# Altium schematic sheet AdjRegSection.SchDoc
size A3; SheetNumber: 1; SheetTotal: 3
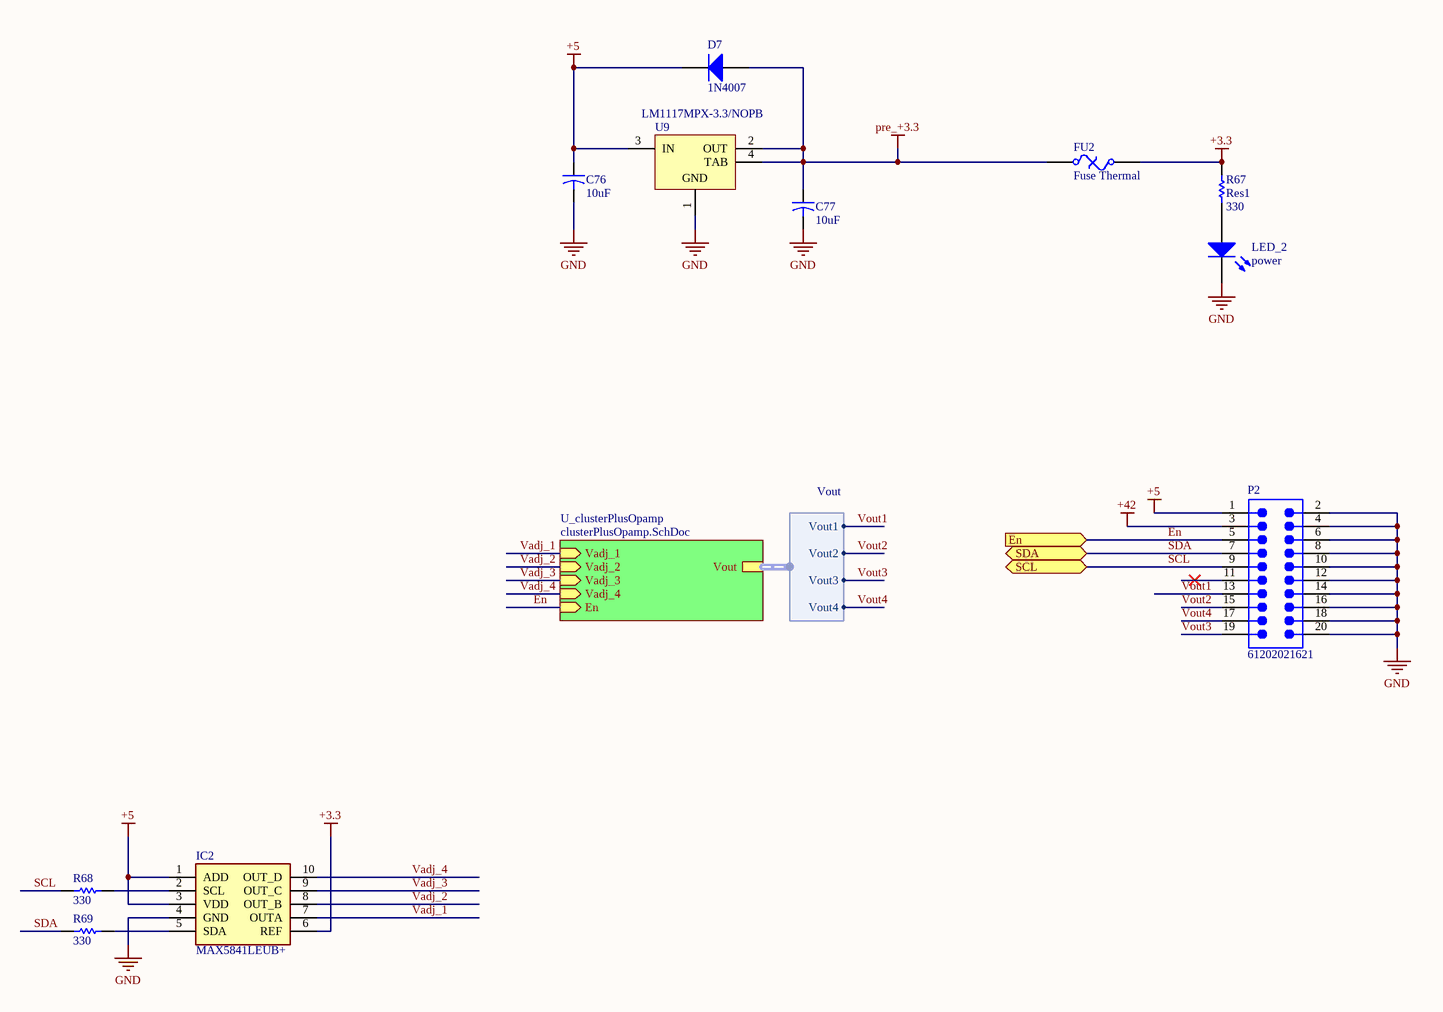
[diagram p0: AdjRegSection.SchDoc]

## Parts
C76  value 10uF  [0805C]  (hidden comment: Cap_El)
C77  value 10uF  [0805C]  (hidden comment: Cap_El)
D7  1N4007  [430X270D]
FU2  Fuse Thermal  [1206]
IC2  MAX5841LEUB+  [SOP50P490X110-10N]
LED_2  power  [0805LED]
P2  61202021621  [61202021621]
R67  Res1  value 330  [0805L]
R68  330  [RESC3216X70X50NL05T20]
R69  330  [RESC3216X70X50NL05T20]
U9  LM1117MPX-3.3/NOPB  [DCY0004A_L]

## Sub-sheets
U_clusterPlusOpamp = clusterPlusOpamp.SchDoc: En (in), Vadj_1 (in), Vadj_2 (in), Vadj_3 (in), Vadj_4 (in), Vout (harness Vout)

## Ports
En (in), SCL (bidir), SDA (bidir)

## Harnesses
Vout: Vout1, Vout2, Vout3, Vout4

## Nets
+3.3: FU2.2 IC2.6(REF) R67.1
+5: C76.1 D7.2(K) IC2.1(ADD) IC2.3(VDD) P2.1 U9.3(IN)
+42: P2.3
GND: C76.2 C77.2 IC2.4(GND) LED_2.2(K) P2.2 P2.4 P2.6 P2.8 P2.10 P2.12 P2.14 P2.16 P2.18 P2.20 U9.1(GND)
pre_+3.3: C77.1 D7.1(A) FU2.1 U9.2(OUT) U9.4(TAB)
En: P2.5 ; port En, sheet U_clusterPlusOpamp/En
SCL: P2.9 R68.2 ; port SCL
SDA: P2.7 R69.2 ; port SDA
Vadj_1: IC2.7(OUTA) ; sheet U_clusterPlusOpamp/Vadj_1
Vadj_2: IC2.8(OUT_B) ; sheet U_clusterPlusOpamp/Vadj_2
Vadj_3: IC2.9(OUT_C) ; sheet U_clusterPlusOpamp/Vadj_3
Vadj_4: IC2.10(OUT_D) ; sheet U_clusterPlusOpamp/Vadj_4
Vout1: P2.13 ; sheet U_clusterPlusOpamp/Vout.Vout1
Vout2: P2.15 ; sheet U_clusterPlusOpamp/Vout.Vout2
Vout3: P2.19 ; sheet U_clusterPlusOpamp/Vout.Vout3
Vout4: P2.17 ; sheet U_clusterPlusOpamp/Vout.Vout4
NetIC2_2: IC2.2(SCL) R68.1
NetIC2_5: IC2.5(SDA) R69.1
NetLED_2_1: LED_2.1(A) R67.2

Not connected (* = marked no-connect by the designer): P2 11*

## Library data of the parts
C76 C77 = Cap_El: Capacitor; Published: 23-Sep-2002; PackageReference: CAPR5-4X5; Publisher: Altium Limited
D7 = Diode: 1 Amp General Purpose Rectifier; Revision 1: 11-Jul-2000: SIM Model Added.; Revision 2: 17-Jul-2002: Re-released for DXP Platform.; Package Information: Latest Revision: Aug-1999; Code - JEDEC: DO-204-AL; Published: 8-Jun-2000; Datasheet: Latest Revision: 1998; Package Reference: DO-41; Publisher: Altium Limited
FU2 = Fuse Thermal: Thermal Fuse; Published: 24-Mar-1999; LatestRevisionDate: 17-Jul-2002; LatestRevisionNote: Re-released for DXP Platform.; PackageReference: PIN-W2/E2.8; Publisher: Altium Limited; PackageDescription: Thru-Hole; 2 Leads
IC2 = MAX5841LEUB+: Integrated Circuit; Manufacturer_Name: Analog Devices; Datasheet Link: https://datasheets.maximintegrated.com/en/ds/MAX5841.pdf; Height: 1.1mm; Manufacturer_Part_Number: MAX5841LEUB+; Mouser Part Number: 700-MAX5841LEUB; Mouser Price/Stock: https://www.mouser.co.uk/ProductDetail/Maxim-Integrated/MAX5841LEUB%2b?qs=9Cj2FLRihcMjPr0cjsKN4w%3D%3D
LED_2 = LED3: Typical BLUE SiC LED; Published: 8-Jun-2000; LatestRevisionDate: 17-Dec-2003; LatestRevisionNote: PCB Footprint replaced.; DatasheetDocument: 16-Apr-2002; PackageDocument: 16-Apr-2002; PackageReference: 3.5X2.8X1.9; Publisher: Altium Limited
P2 = CMP-1502-00010-2: NexarPartId: 8917785; Number of Positions: 20; Row Spacing: 2.54mm; Voltage Rating (DC): 250V; Gender: Male; Insulation Resistance: 1GΩ; Current Rating: 3A; Connector Type: Male Pin; Contact Resistance: 20mΩ; Insulation: Insulated; Contact Material: Copper; REACH SVHC: Unknown; Width: 33.06mm; Pitch: 2.54mm; Housing Material: PBT; Number of Contacts: 20; Contact Plating: Gold; Mount: Through Hole; Termination: Through Hole; Number of Pins: 20; Color: Black; Max Operating Temperature: 105°C; Contact Gender: Male; Voltage Rating: 250V; Lead Pitch: 2.54mm; Operating Supply Voltage: 250V; Length: 33.06mm; Orientation: Vertical; Number of Rows: 2; Flammability Rating: UL94 V-0; RoHS: Compliant; Insulation Material: PBT; Min Operating Temperature: -40°C; Height: 8.85mm
R67 = Res1: Resistor; Published: 8-Jun-2000; LatestRevisionDate: 17-Jul-2002; LatestRevisionNote: Re-released for DXP Platform.; PackageReference: AXIAL-0.3; Publisher: Altium Limited
R68 R69 = CMP-2003-00782-1: Part Number: ERJ8BWFR068V; Manufacturer: Panasonic
U9 = CMP-0062-01639-4: 800mA Low-Dropout Linear Regulator, 4-pin SOT-223, Pb-Free; Manufacturer: Texas Instruments; High-Reliability: Y; PowerWise: N; PackageTopMarking: XYTT*N05A; CompType: LDO IC; ComponentLink1URL: http://www.ti.com/general/docs/lit/getliterature.tsp?genericPartNumber=LM1117-N&fileType=pdf; PartNumber: LM1117MPX-3.3/NOPB; ComponentLink1Description: Datasheet URL; PinCount: 4; Code_JEDEC: TO-261-AA; PackageDescription: Molded SOT-223, 6.50 x 3.56 x 1.6mm Body, 4 Lead, 2.3mm Pitch; PackageReference: DCY0004A; RoHS: Y; Code_IPC: SOT223-4